# EAGLE design APA102_Arduino (EAGLE 9.6.2)
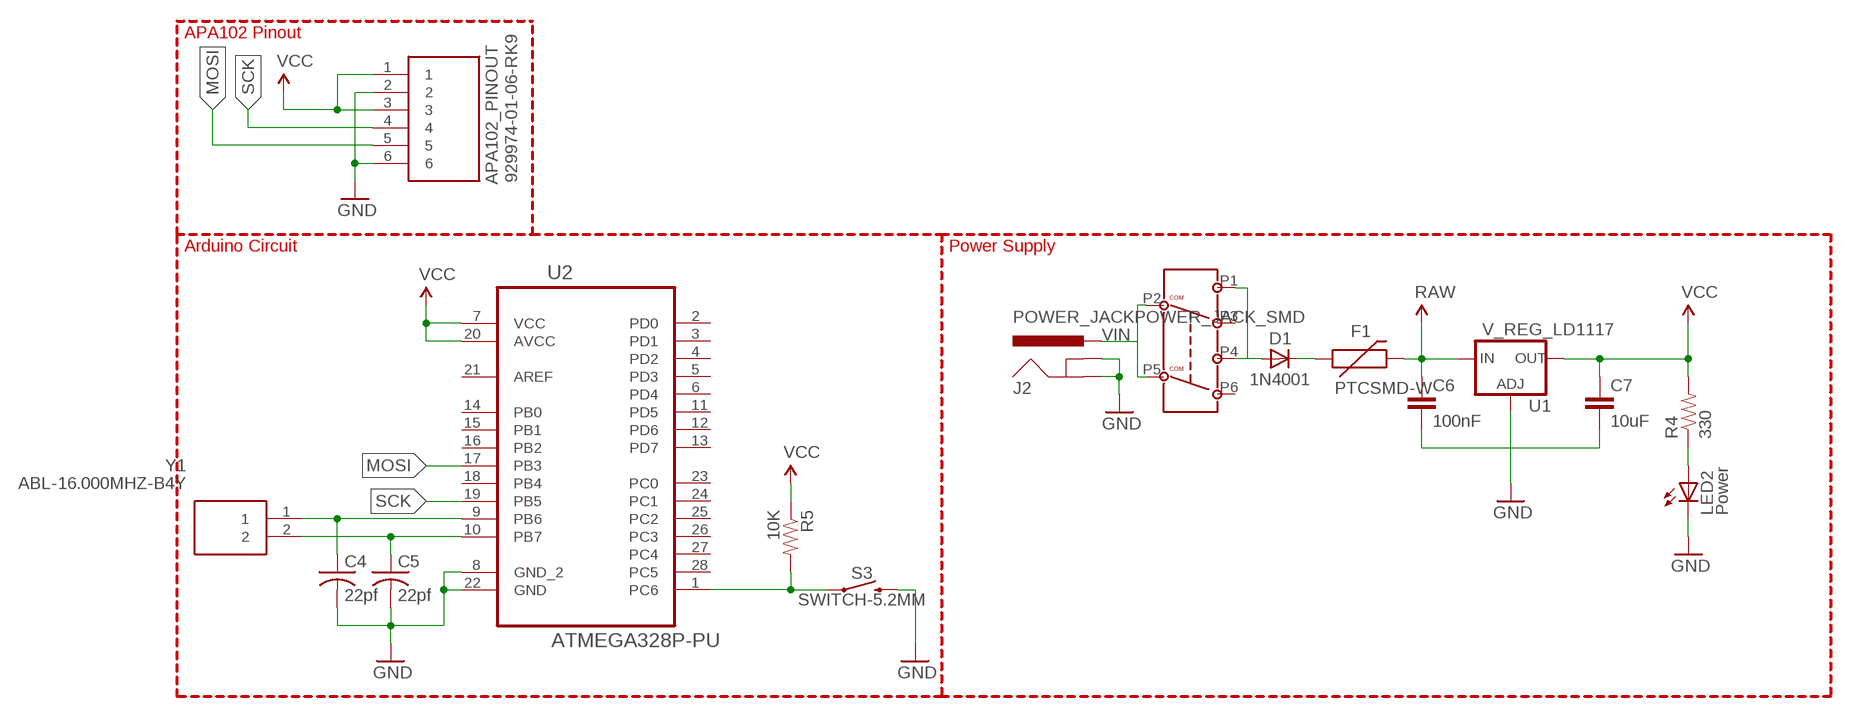
[diagram p0: schematic, sheet 1]

## Parts
APA102_PINOUT  929974-01-06-RK9  929974-01-06-RK929974-01-06-RK  [929974-01-06-RK]
C4  22pf  C-USC0805  [C0805]
C5  22pf  C-USC0805  [C0805]
C6  100nF  CAP0603-CAP  [0603-CAP]
C7  10uF  CAP0603-CAP  [0603-CAP]
D1  1N4001  1N4004  [DO41-10]
F1  PTCSMD-W  [PTC-1206-WIDE]
J2  POWER_JACKPOWER_JACK_SMD  [POWER_JACK_SMD]
LED2  Power  LED1206  [LED-1206]
POWER_SWITCH  6-PIN-SLIDE-SWITCH  [6-PIN-SLIDE-SWITCH]
R4  330  RESISTOR0603-RES  [0603-RES]
R5  10K  RESISTOR0603-RES  [0603-RES]
S3  SWITCH-5.2MM  MOMENTARY-SWITCH-SPST-SMD-5.2MM  [TACTILE_SWITCH_SMD_5.2MM]
U1  V_REG_LD1117  V_REG_317SMD  [SOT223]
U2  ATMEGA328P-PU  [DIP254P762X457-28]
Y1  ABL-16.000MHZ-B4Y  [HC/49US_(AT49)PTH]

## Nets
GND: APA102_PINOUT.2 APA102_PINOUT.6 C4.2 C5.2 C6.2 C7.2 J2.GND J2.P$4(GNDBREAK) LED2.C S3.3 U1.1(ADJ) U2.8(GND_2) U2.22(GND)
MOSI: APA102_PINOUT.5 U2.17(PB3)
N$1: D1.C F1.1
N$3: C4.1 U2.9(PB6) Y1.1
N$6: C5.1 U2.10(PB7) Y1.2
N$7: R5.2 S3.1 U2.1(PC6)
N$8: LED2.A R4.1
N$9: D1.A POWER_SWITCH.P1 POWER_SWITCH.P4
RAW: C6.1 F1.2 U1.3(IN)
SCK: APA102_PINOUT.4 U2.19(PB5)
VCC: APA102_PINOUT.1 APA102_PINOUT.3 C7.1 R4.2 R5.1 U1.2(OUT) U2.7(VCC) U2.20(AVCC)
VIN: J2.VIN0(PWR) POWER_SWITCH.P2 POWER_SWITCH.P5
Unconnected: POWER_SWITCH.P3 POWER_SWITCH.P6 U2.2(PD0) U2.3(PD1) U2.4(PD2) U2.5(PD3) U2.6(PD4) U2.11(PD5) U2.12(PD6) U2.13(PD7) U2.14(PB0) U2.15(PB1) U2.16(PB2) U2.18(PB4) U2.21(AREF) U2.23(PC0) U2.24(PC1) U2.25(PC2) U2.26(PC3) U2.27(PC4) U2.28(PC5)

## Notes on the sheet
- APA102 Pinout
- Arduino Circuit | Power Supply

## Library data of the parts
APA102_PINOUT = SamacSys_Parts:929974-01-06-RK: Conn Socket Strip SKT 6 POS 2.54mm Solder ST Thru-Hole Source: Datasheet <https://www.arrow.com/en/products/929974-01-06-rk/3m>
C4 C5 = resistor:C-US: CAPACITOR, American symbol
C6 C7 = SparkFun:CAP: Capacitor Standard 0603 ceramic capacitor, and 0.1" leaded capacitor.
D1 = adafruit:1N4004: DIODE General purpose 1N400x type rectifier (With bigger pads) http://www.ladyada.net/library/pcb/eaglelibrary.html
F1 = SparkFun-PowerIC:PTC: Resettable Fuse PTC Resettable Fuse. Spark Fun Electronics SKU : COM-08357
J2 = Magister-Libraries:POWER_JACK: Power Jack Connector This is the standard 5.5mm barrel jack for power. The PTH is the most common, proven, reliable, footprint. The Slot footprint only works if the mill layer is transmitted to the PCB fab house so be warned. Here are the connectors we sell at SparkFun: DC Barrel Power Jack/Connector <https://www.sparkfun.com/products/119> (PRT-00119) DC Barrel Power Jack/Connector (SMD) <https://www.sparkfun.com/products/12748> (PRT-12748) DC Barrel Jack Adapter - Breadboard Compatible <https://www.sparkfun.com/products/10811> (PRT-10811) It is used on this SparkFun product (and many, many others): SparkFun RedBoard - Programmed with Arduino <https://www.sparkfun.com/products/12757> (DEV-12757) Also, if you need a mating power supply or connector, please check these out: Wall Adapter Power Supply - 9VDC 650mA <https://www.sparkfun.com/products/298> (TOL-00298) DC Barrel Jack Adapter - Male <https://www.sparkfun.com/products/10287> (PRT-10287)
LED2 = SparkFun-Nate:LED
POWER_SWITCH = Magister-Libraries:6-PIN-SLIDE-SWITCH
R4 R5 = SparkFun:RESISTOR: Resistor Basic schematic elements and footprints for 0603, 1206, and PTH resistors.
S3 = SparkFun-Switches:MOMENTARY-SWITCH-SPST: Momentary Switch (Pushbutton) - SPST Normally-open (NO) SPST momentary switches (buttons, pushbuttons). Variants PTH-12MM - 12mm square, through-hole Momentary Pushbutton Switch - 12mm Square <https://www.sparkfun.com/products/9190> (COM-09190) PTH-6.0MM, PTH-6.0MM-KIT - 6.0mm square, through-hole Mini Pushbutton Switch <https://www.sparkfun.com/products/97> (COM-00097) KIT package intended for soldering kit's - only one side of pads' copper is exposed. PTH-RIGHT-ANGLE-KIT - Right-angle, through-hole Right Angle Tactile Button <https://www.sparkfun.com/products/10791> - Used on SparkFun BigTime Watch Kit <https://www.sparkfun.com/products/11734> SMD-12MM - 12mm square, surface-mount Tactile Button - SMD (12mm) <https://www.sparkfun.com/products/12993> (COM-12993) Used on SparkFun PicoBoard <https://www.sparkfun.com/products/11888> SMD-4.5MM - 4.5mm Square Trackball Switch Used on SparkFun Blackberry Trackballer Breakout <https://www.sparkfun.com/products/13169> SMD-4.6MMX2.8MM - 4.60mm x 2.80mm, surface mount Used on SparkFun SAMD21 Mini Breakout <https://www.sparkfun.com/products/13664> SMD-5.2MM, SMD-5.2-REDUNDANT - 5.2mm square, surface-mount Mini Pushbutton Switch - SMD <https://www.sparkfun.com/products/8720> (COM-08720) Used on Arduino Pro Mini <https://www.sparkfun.com/products/11114> REDUNDANT package connects both switch circuits together SMD-6.0X3.5MM - 6.0 x 3.5mm, surface mount Momentary Reset Switch SMD <https://www.sparkfun.com/products/8229> (COM-08229) SMD-6.2MM-TALL - 6.2mm square, surface mount Tactile Button - SMD (6mm) <https://www.sparkfun.com/products/12992> Used on SparkFun Digital Sandbox <https://www.sparkfun.com/products/12651> SMD-RIGHT-ANGLE - Right-angle, surface mount Used on SparkFun Block for Intel® Edison - Arduino <https://www.sparkfun.com/products/13036>; PROD_ID: SWCH-08247; SF_SKU: COM-08720
U1 = SparkFun:V_REG_317: Voltage Regulator Standard LM317 adjustable voltage regulator. AOI (Adjust Output Input). Google 'LM317 Calculator' for easy to use app to get the two resistor values needed. 240/720 for 5V output. 240/390 for 3.3V output. Spark Fun Electronics SKU : COM-00527
U2 = ATMEGA328P-PU:ATMEGA328P-PU: 8-bit Microcontroller with In-System Programmable Flash; AVAILABILITY: Unavailable; DESCRIPTION: AVR AVR® ATmega Microcontroller IC 8-Bit 20MHz 32KB _16K x 16_ FLASH 28-PDIP; MF: Microchip; MP: ATMEGA328P-PU; PACKAGE: PDIP-28 Microchip; PRICE: None
Y1 = Magister-Libraries:ABL-16.000MHZ-B4Y: Crystals 16.000MHZ, 18pF 30ppm -20C +70C Source: Datasheet <https://abracon.com/Resonators/ABL.pdf>; DESCRIPTION: Crystals 16.000MHZ, 18pF 30ppm -20C +70C; HEIGHT: mm; MANUFACTURER_NAME: ABRACON; MANUFACTURER_PART_NUMBER: ABL-16.000MHz-B4Y; MOUSER_PART_NUMBER: 815-ABL-16-B4Y; MOUSER_PRICE-STOCK: https://www.mouser.co.uk/ProductDetail/ABRACON/ABL-16000MHz-B4Y?qs=DZ%2FvJMgWWIsyUPmWNxNaQw%3D%3D

## Net classes
0 default: width 0.203 mm
1 power: width 0.508 mm

## Board
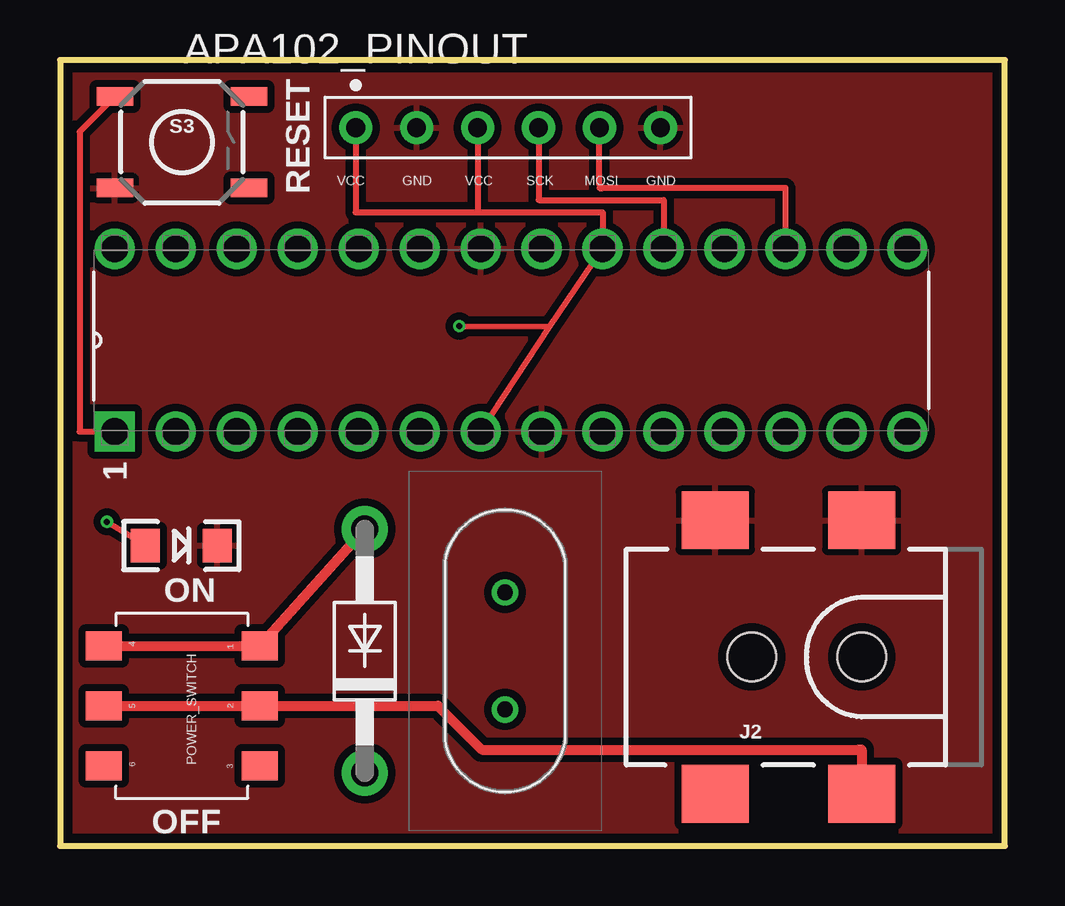
[diagram p1: board, top side]
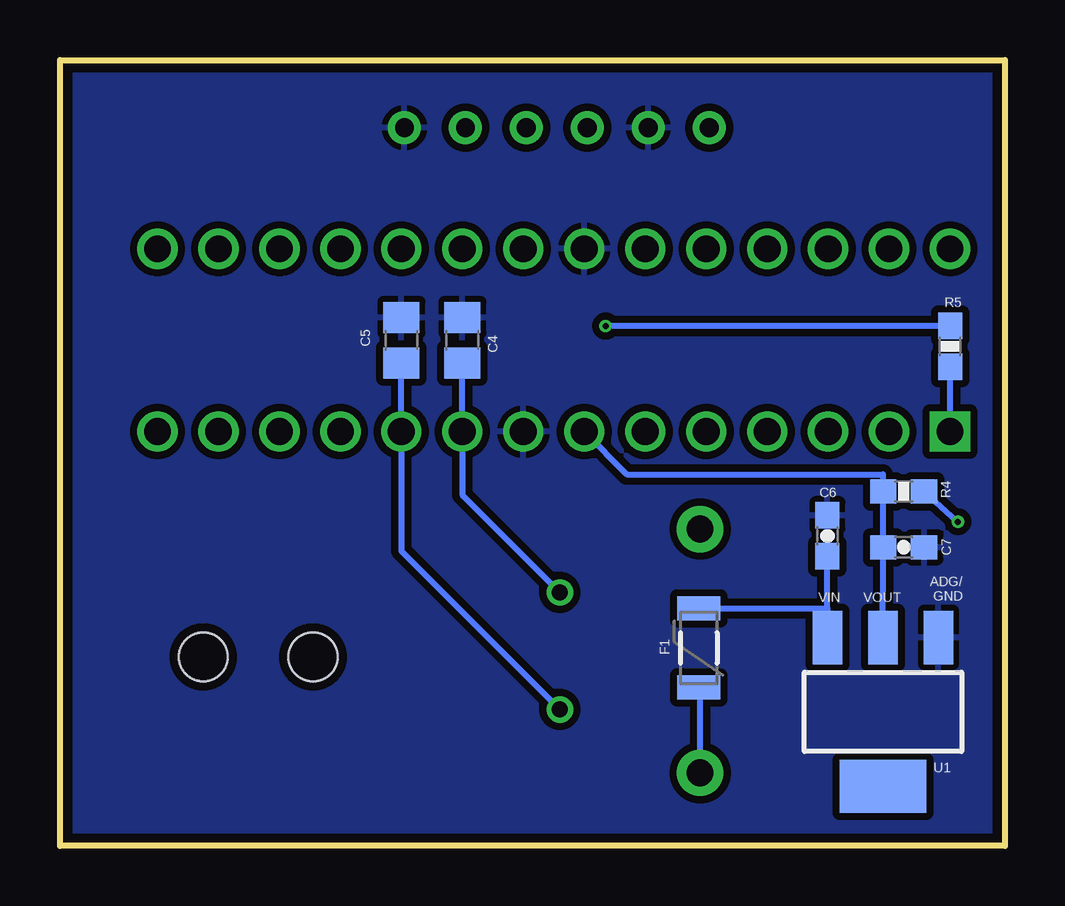
[diagram p2: board, bottom side, seen from below]

Size 39.37 x 32.77 mm. Coordinates in mm from the lower left corner, seen from the top.
Outline: 0,0 39.37,0 39.37,32.77 0,32.77 0,0
Copper layers (1*16): Top 0.035559375mm / dielectric 1.6mm / Bottom 0.035559375mm
Design rules "oshpark-2layer": minimum track width 6mil, minimum drill 10mil, track to track 6mil, track to pad 6mil, pad to pad 6mil, via to via 6mil, smd to smd 6mil, copper to edge 15mil, drill to drill 6mil, minimum pad ring 5mil, minimum via ring 5mil, stop-mask expansion 2.5mil, vias tented up to drill 0mil, thermal gap 10mil

### Footprints (pad centres in the part's own frame; a part is rotated, then mirrored left to right if it is on the bottom)
929974-01-06-RK = drill 0.78 pad 1.38: 1 0,0; 2 2.54,0; 3 5.08,0; 4 7.62,0; 5 10.16,0; 6 12.7,0
C0805 = smd 1.3 x 1.5: 1 -0.95,0; 2 0.95,0
0603-CAP = smd 1.1 x 1: 1 -0.85,0; 2 0.85,0
DO41-10 = drill 1.118 pad 1.93: A 5.08,0; C -5.08,0
PTC-1206-WIDE = smd 1 x 1.8: 1 -1.654,0; 2 1.654,0
POWER_JACK_SMD = smd 2.8 x 2.4: GND 0,-5.7; P$4 6.1,-5.7; VIN0 0,5.7; VIN1 6.1,5.7 | hole 2.032: 0,0; 4.572,0
LED-1206 = smd 1.2 x 1.4: A -1.5,0; C 1.5,0
6-PIN-SLIDE-SWITCH = smd 1.2 x 1.5: P1 -2.5,3.25; P2 0,3.25; P3 2.5,3.25; P4 -2.5,-3.25; P5 0,-3.25; P6 2.5,-3.25
0603-RES = smd 1.1 x 1: 1 -0.85,0; 2 0.85,0
TACTILE_SWITCH_SMD_5.2MM = smd 1.524 x 0.762: 1 -2.794,1.905; 2 2.794,1.905; 3 -2.794,-1.905; 4 2.794,-1.905
SOT223 = smd 1.219 x 2.235: 1 -2.311,-3.099; 2 0,-3.099; 3 2.311,-3.099 | smd 3.6 x 2.2: 4 0,3.099
DIP254P762X457-28 = drill 1.118 square: 1 -7.62,33.02 | drill 1.118: 2 -7.62,30.48; 3 -7.62,27.94; 4 -7.62,25.4; 5 -7.62,22.86; 6 -7.62,20.32; 7 -7.62,17.78; 8 -7.62,15.24; 9 -7.62,12.7; 10 -7.62,10.16; 11 -7.62,7.62; 12 -7.62,5.08; 13 -7.62,2.54; 14 -7.62,0; 15 0,0; 16 0,2.54; 17 0,5.08; 18 0,7.62; 19 0,10.16; 20 0,12.7; 21 0,15.24; 22 0,17.78; 23 0,20.32; 24 0,22.86; 25 0,25.4; 26 0,27.94; 27 0,30.48; 28 0,33.02
HC/49US_(AT49)PTH = drill 0.66 pad 1.1: 1 -2.44,0; 2 2.44,0

### Placement (x,y rotation side)
APA102_PINOUT  12.32,29.95 0 top
C4  22.61,21.08 90 bottom
C5  25.15,21.08 90 bottom
C6  7.39,12.93 90 bottom
C7  4.22,12.45 0 bottom
D1  12.7,8.13 90 top
F1  12.75,8.26 90 bottom
J2  33.4,7.87 180 top
LED2  5.05,12.52 0 top
POWER_SWITCH  5.08,5.84 270 top
R4  4.22,14.78 180 bottom
R5  2.29,20.83 270 bottom
S3  5.08,29.34 0 top
U1  5.08,5.59 180 bottom
U2  35.31,24.89 90 top
Y1  18.54,8.13 270 top

### Tracks (layer width: path | path; a pad name or v marks a point on that pad's centre or on a via)
GND
  pour Bottom (isolate 0.305): 0,32.77 39.37,32.77 39.37,0 0,0
  pour Top (isolate 0.305): 0,0 0,32.77 39.37,32.77 39.37,0
MOSI
  Top 0.254: 22.48,27.43 22.61,27.43 | 22.61,27.43 30.23,27.43 U2.17 | 22.61,27.43 22.48,27.56 APA102_PINOUT.5
N$1
  Bottom 0.254: D1.C 12.7,6.86 F1.1
N$3
  Bottom 0.254: C4.1 U2.9 22.61,14.63 Y1.1
N$6
  Bottom 0.254: C5.1 U2.10 25.15,12.29 Y1.2
N$7
  Top 0.254: S3.1 0.81,29.77 0.81,17.27 U2.1
  Bottom 0.254: U2.1 R5.2
N$8  (via drill 0.25 pad 0.25)
  Top 0.254: LED2.A v1.96,13.51
  Bottom 0.254: v1.96,13.51 R4.1
N$9
  Top 0.406: POWER_SWITCH.P4 POWER_SWITCH.P1 D1.A
RAW
  Bottom 0.254: C6.1 U1.3 7.39,9.91 F1.2
SCK
  Top 0.254: U2.19 25.15,26.92 19.94,26.92 APA102_PINOUT.4
VCC  (via drill 0.25 pad 0.25)
  Top 0.254: U2.7 20.4,21.65 | 20.4,21.65 U2.20 22.61,26.42 17.4,26.42 | 17.4,26.42 12.32,26.42 APA102_PINOUT.1 | v16.64,21.67 20.4,21.65 | APA102_PINOUT.3 17.4,26.42
  Bottom 0.254: U1.2 C7.1 R4.2 5.08,15.49 15.75,15.49 U2.7 | R5.1 v16.64,21.67
VIN
  Top 0.406: POWER_SWITCH.P5 POWER_SWITCH.P2 15.75,5.84 17.58,4.01 33.27,4.01 33.4,4.01 J2.VIN0

### Text on the board
tPlace: VCC | GND | VCC | SCK | MOSI | GND | RESET | 1 | ON | OFF
bPlace: ADG/ / GND | VOUT | VIN